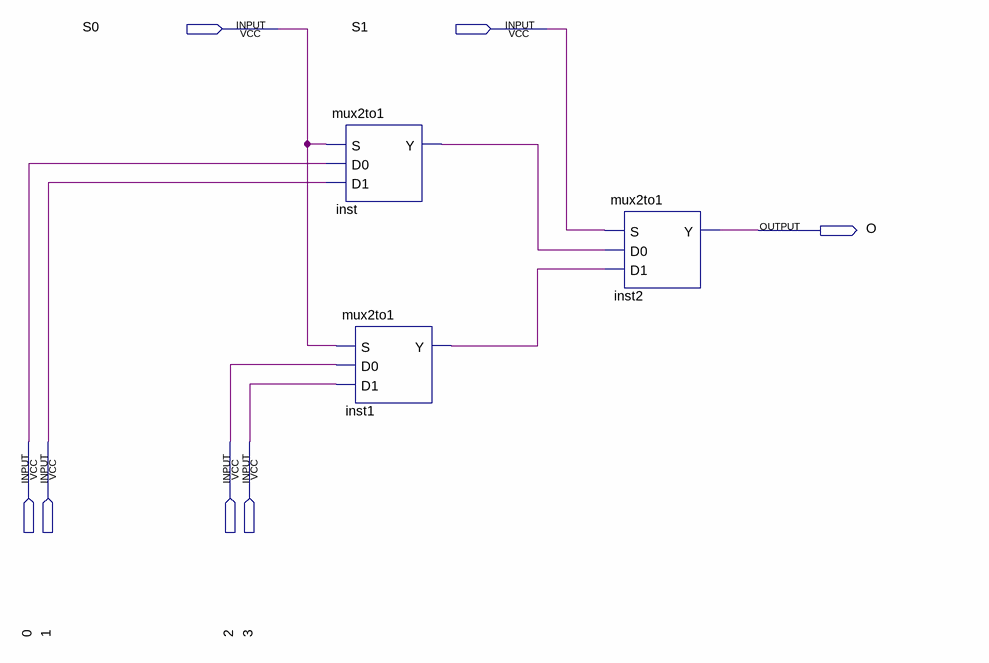
[diagram p0: schematic sheet]
// Quartus schematic Mux4to1.bdf as structural Verilog: 3 symbols, 7 pins
module Mux4to1 (
  input  S0,
  input  S1,
  input  \0 ,
  input  \1 ,
  input  \2 ,
  input  \3 ,
  output O
);

  wire inst1_y, inst_y;

  mux2to1 inst (.S(S0), .D0(\0 ), .D1(\1 ), .Y(inst_y));
  mux2to1 inst1 (.S(S0), .D0(\2 ), .D1(\3 ), .Y(inst1_y));
  mux2to1 inst2 (.S(S1), .D0(inst_y), .D1(inst1_y), .Y(O));
endmodule
